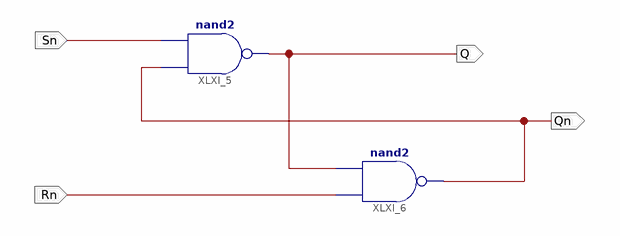
[diagram p0: schematic sheet 1]
// Xilinx ISE schematic RS_NAND.sch (kintex7) as structural Verilog: 2 symbols, 4 ports
module RS_NAND (
  input  Sn,
  input  Rn,
  output Q,
  output Qn
);

  nand XLXI_5 (Q, Qn, Sn);
  nand XLXI_6 (Qn, Rn, Q);
endmodule
